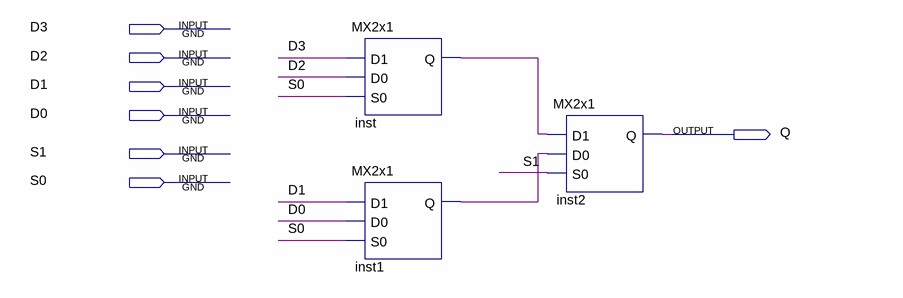
[diagram p0: schematic sheet]
// Quartus schematic MX4x1.bdf as structural Verilog: 3 symbols, 7 pins
module MX4x1 (
  input  D3,
  input  D2,
  input  D1,
  input  D0,
  input  S1,
  input  S0,
  output Q
);

  wire inst1_q, inst_q;

  MX2x1 inst (.D1(D3), .D0(D2), .S0(S0), .Q(inst_q));
  MX2x1 inst1 (.D1(D1), .D0(D0), .S0(S0), .Q(inst1_q));
  MX2x1 inst2 (.D1(inst_q), .D0(inst1_q), .S0(S1), .Q(Q));
endmodule
